# Altium schematic sheet Sheet1.SchDoc
size A4
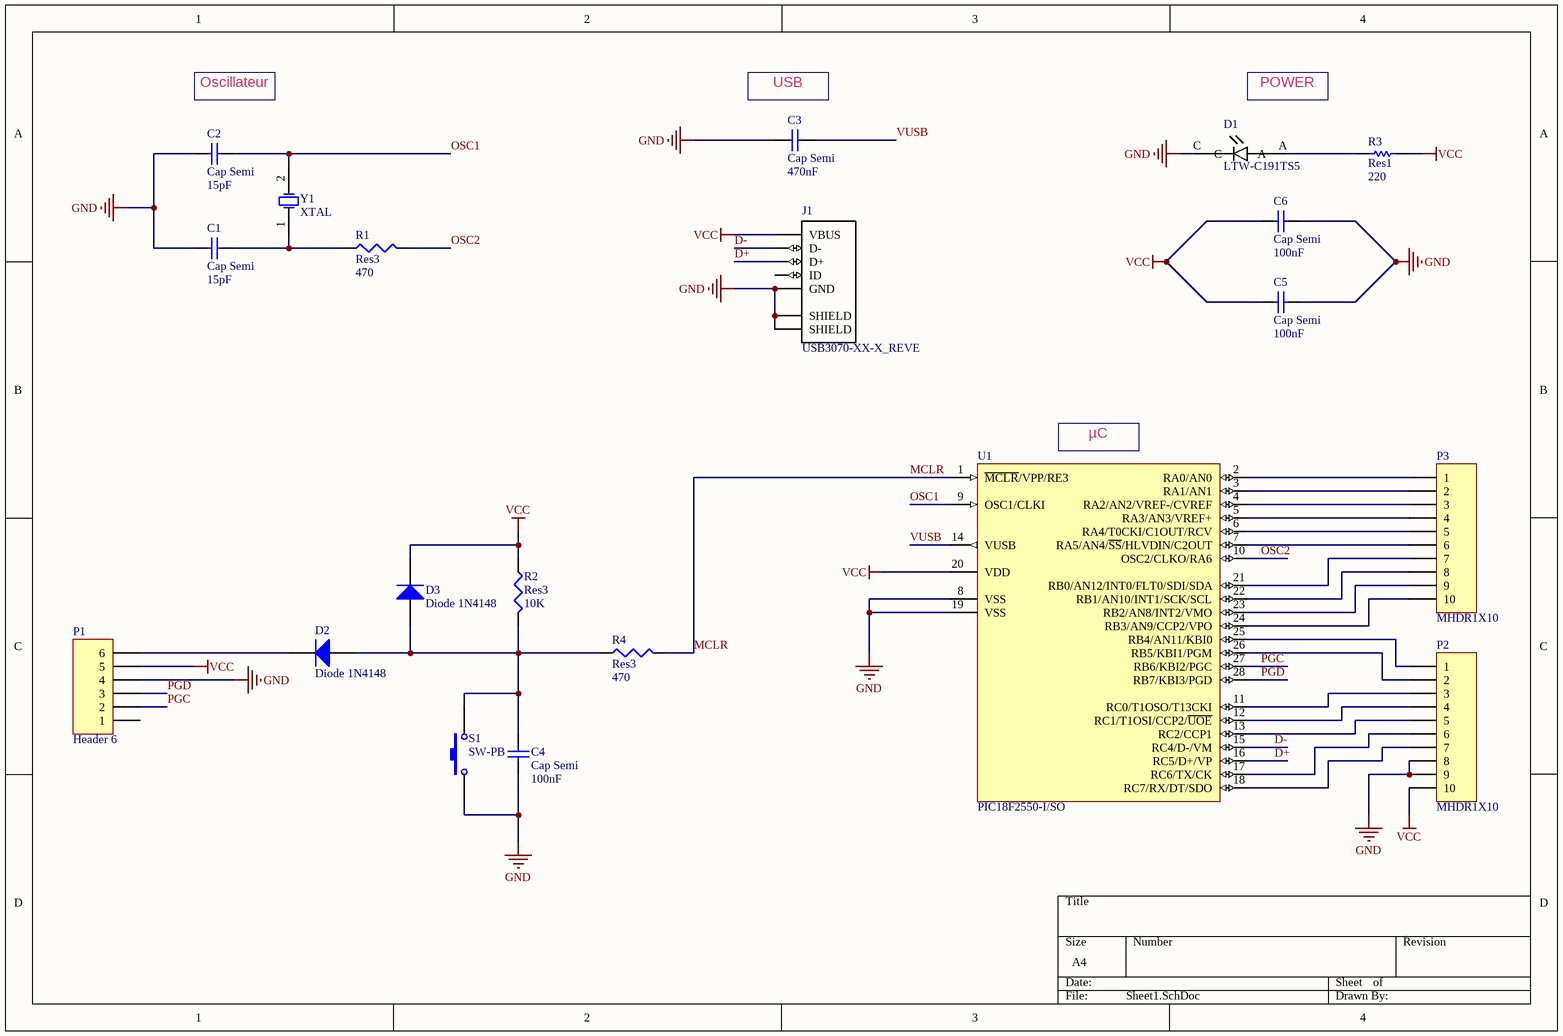
[diagram p0: Sheet1.SchDoc]

## Parts
C1  Cap Semi  value 15pF  [C1206]
C2  Cap Semi  value 15pF  [C1206]
C3  Cap Semi  value 470nF  [C1206]
C4  Cap Semi  value 100nF  [C1206]
C5  Cap Semi  value 100nF  [C1206]
C6  Cap Semi  value 100nF  [C1206]
D1  LTW-C191TS5  [LEDM1608X55_LTW-C191TS5(Primary)]
D2  Diode 1N4148  [DO-35]
D3  Diode 1N4148  [DO-35]
J1  USB3070-XX-X_REVE  [GCT_USB3070-XX-X_REVE]
P1  Header 6  [HDR1X6]
P2  MHDR1X10  [MHDR1X10]
P3  MHDR1X10  [MHDR1X10]
R1  Res3  value 470  [J1-0603]
R2  Res3  value 10K  [J1-0603]
R3  Res1  value 220  [AXIAL-0.3]
R4  Res3  value 470  [J1-0603]
S1  SW-PB  [SPST-2]
U1  PIC18F2550-I/SO  [SOIC-SO28_N]
Y1  XTAL  [R38]

## Nets
GND: C1.1 C2.1 C3.1 C4.1 C5.1 C6.1 D1.C J1.5(GND) J1.6(SHIELD) J1.7(SHIELD) P1.4 P2.8 P2.9 S1.1 U1.8(VSS) U1.19(VSS)
VCC: C5.2 C6.2 D3.2(K) J1.1(VBUS) P1.5 P2.10 R2.1 R3.1 U1.20(VDD)
D+: J1.3(D+) U1.16(RC5/D+/VP)
D-: J1.2(D-) U1.15(RC4/D-/VM)
MCLR: R4.2 U1.1(~{MCLR}/VPP/RE3)
OSC1: C2.2 U1.9(OSC1/CLKI) Y1.2(OSC2)
OSC2: R1.2 U1.10(OSC2/CLKO/RA6)
PGC: P1.2 U1.27(RB6/KBI2/PGC)
PGD: P1.3 U1.28(RB7/KBI3/PGD)
VUSB: C3.2 U1.14(VUSB)
NetC1_2: C1.2 R1.1 Y1.1(OSC1)
NetC4_2: C4.2 D2.1(A) D3.1(A) R2.2 R4.1 S1.2
NetD1_A: D1.A R3.2
NetD2_2: D2.2(K) P1.6
NetP2_1: P2.1 U1.25(RB4/AN11/KBI0)
NetP2_2: P2.2 U1.26(RB5/KBI1/PGM)
NetP2_3: P2.3 U1.11(RC0/T1OSO/T13CKI)
NetP2_4: P2.4 U1.12(RC1/T1OSI/CCP2/~{UOE})
NetP2_5: P2.5 U1.13(RC2/CCP1)
NetP2_6: P2.6 U1.17(RC6/TX/CK)
NetP2_7: P2.7 U1.18(RC7/RX/DT/SDO)
NetP3_1: P3.1 U1.2(RA0/AN0)
NetP3_2: P3.2 U1.3(RA1/AN1)
NetP3_3: P3.3 U1.4(RA2/AN2/VREF-/CVREF)
NetP3_4: P3.4 U1.5(RA3/AN3/VREF+)
NetP3_5: P3.5 U1.6(RA4/T0CKI/C1OUT/RCV)
NetP3_6: P3.6 U1.7(RA5/AN4/~{SS}/HLVDIN/C2OUT)
NetP3_7: P3.7 U1.21(RB0/AN12/INT0/FLT0/SDI/SDA)
NetP3_8: P3.8 U1.22(RB1/AN10/INT1/SCK/SCL)
NetP3_9: P3.9 U1.23(RB2/AN8/INT2/VMO)
NetP3_10: P3.10 U1.24(RB3/AN9/CCP2/VPO)

Not connected (* = marked no-connect by the designer): J1 4(ID); P1 1

## Notes on the sheet
- Oscillateur
- (near C3) USB
- POWER
- (near U1) µC

## Library data of the parts
C1-C6 = Cap Semi: Capacitor (Semiconductor SIM Model); Published: 8-Jun-2000; LatestRevisionDate: 29-May-2009; LatestRevisionNote: IPC-7351 Footprint Added.; PackageReference: C1206; Publisher: Altium Limited; PackageDescription: Chip Capacitor
D1 = LTW-C191TS5: Yellow 1.6 x 0.8 x 0.55 mm 130%C2%B0 Tinted/Diffused 180 mcd 3.15V LED Surface Mount; MF: Lite-On; Availability: Good; Price: 0.19 USD; Package: 0603 Lite-On; MP: LTW-C191TS5; Value: *
D2 D3 = Diode 1N4148: High Conductance Fast Diode; Published: 8-Jun-2000; LatestRevisionDate: 17-Jul-2002; LatestRevisionNote: Re-released for DXP Platform.; DatasheetVersion: 1997; PackageReference: DO-35; Publisher: Altium Limited; PackageDescription: Diode, Axial; Body 3.8 x 1.9 mm (LxDia. max), Lead Dia. 0.53 mm (max); Code_JEDEC: DO-204-AH; ComponentLink1Description: Manufacturer Link; ComponentLink1URL: http://www.fairchildsemi.com/; ComponentLink2Description: Datasheet; ComponentLink2URL: http://www.fairchildsemi.com/ds/1N%2F1N4148.pdf
J1 = USB3070-XX-X_REVE: 5 Position Surface Mount Right Angle Micro USB 2.0 Connector; MP: USB3070-30-A; MF: Global Connector Technology; Package: None; Price: 0.39 USD; Availability: Good; Value: *
P1 = Header 6: Header, 6-Pin; LatestRevisionDate: 17-Jul-2002; LatestRevisionNote: Re-released for DXP Platform.; Publisher: Altium Limited
P2 P3 = MHDR1X10: Header, 10-Pin; LatestRevisionDate: 17-Jul-2002; LatestRevisionNote: Re-released for DXP Platform.; Publisher: Altium Limited
R1 R2 R4 = Res3: Resistor; Published: 8-Jun-2000; LatestRevisionDate: 29-May-2009; LatestRevisionNote: IPC-7351 Footprint Added.; PackageReference: J1-0603; Publisher: Altium Limited; PackageDescription: Chip Resistor
R3 = Res1: Resistor; Published: 8-Jun-2000; LatestRevisionDate: 17-Jul-2002; LatestRevisionNote: Re-released for DXP Platform.; PackageReference: AXIAL-0.3; Publisher: Altium Limited; PackageDescription: Axial Device, Thru-Hole; 2 Leads; 0.3 in Pin Spacing
S1 = SW-PB: Switch; Published: 24-Mar-1999; LatestRevisionDate: 17-Jul-2002; LatestRevisionNote: Re-released for DXP Platform.; PackageReference: SPST-2; Publisher: Altium Limited; PackageDescription: Switch; 2 Leads
U1 = PIC18F2550-I/SO: High Performance, Enhanced Flash, USB Microcontroller with nanoWatt Technology, 32K Flash, 28-Pin SOIC, Industrial Temperature Range; Published: 29-Jan-2009; LatestRevisionDate: 02-Dec-2009; LatestRevisionNote: Updated to datasheet revision E, Aug-2008; DatasheetVersion: revE, Aug-2008; PackageVersion: revBB, Aug-2009; PackageReference: SOIC-SO28; Publisher: Altium Limited; PackageDescription: 28-Lead Plastic Small Outline (SO) - Wide 7.50mm Body [SOIC]; Supplier 1: Digi-Key; Supplier Part Number 1: PIC18F2550-I/SO-ND; Supplier 2: Farnell; Supplier Part Number 2: 1660053; Supplier 3: Farnell; Supplier Part Number 3: 9321268; Code_JEDEC: MS-013; ComponentLink1Description: Datasheet; ComponentLink1URL: http://ww1.microchip.com/downloads/en/DeviceDoc/39632e.pdf; ComponentLink2Description: Packaging Specification; ComponentLink2URL: http://www.microchip.com/stellent/groups/techpub_sg/documents/packagingspec/en012702.pdf; ComponentLink3Description: Microchip.com Home; ComponentLink3URL: http://www.microchip.com/
Y1 = XTAL: Crystal Oscillator; Published: 8-Jun-2000; LatestRevisionDate: 17-Jul-2002; LatestRevisionNote: Re-released for DXP Platform.; PackageReference: R38; Publisher: Altium Limited; PackageDescription: Crystal, Thru-Hole; 2 Leads; Body 3.1 x 8.2 mm (Dia.xH)